# Altium schematic sheet Kevin16437_wheel_legged_robot__hardware_Altium_Powerborad_Powerborad_Board1_Schematic1__1_P1.schdoc
size 309 x 223 mm; Symbol: Sheet-Symbol_A4; Device: Sheet-Symbol_A4; Company: 嘉立创EDA; Version: V1.0; Page Size: A4; @Project Name: CAN分板; @Page Count: 1; @Update Date: 2024-08-21; @Create Date: 2024-08-21; @Schematic Name: Schematic1; @Page No: 1; @Page Name: P1; @Board Name: Board1; @Create Time: 05:50:06; @Update Time: 14:13:02
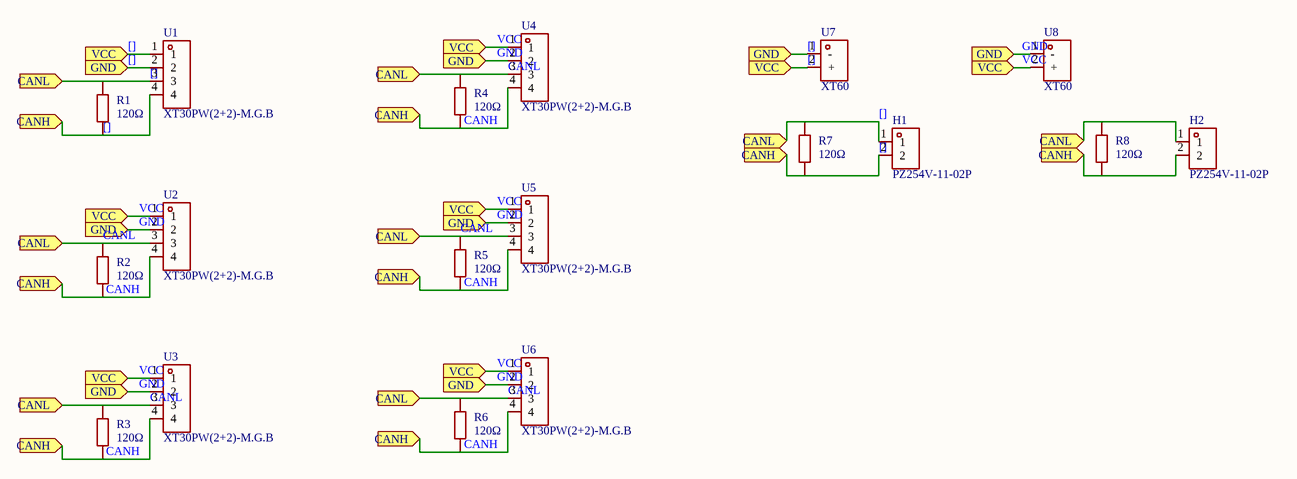
[diagram p0: Kevin16437_wheel_legged_robot__hardware_Altium_Powerborad_Powerborad_Board1_Schematic1__1_P1.schdoc]

## Parts
H1  PZ254V-11-02P  [HDR-TH_2P-P2.54-V-M]  (value not drawn)
H2  PZ254V-11-02P  [HDR-TH_2P-P2.54-V-M]  (value not drawn)
R1  120Ω  [R0805]  (value not drawn)
R2  120Ω  [R0805]  (value not drawn)
R3  120Ω  [R0805]  (value not drawn)
R4  120Ω  [R0805]  (value not drawn)
R5  120Ω  [R0805]  (value not drawn)
R6  120Ω  [R0805]  (value not drawn)
R7  120Ω  [R0805]  (value not drawn)
R8  120Ω  [R0805]  (value not drawn)
U1  XT30PW(2+2)-M.G.B  [CONN-TH_4P-XT30PW-M]  (value not drawn)
U2  XT30PW(2+2)-M.G.B  [CONN-TH_4P-XT30PW-M]  (value not drawn)
U3  XT30PW(2+2)-M.G.B  [CONN-TH_4P-XT30PW-M]  (value not drawn)
U4  XT30PW(2+2)-M.G.B  [CONN-TH_4P-XT30PW-M]  (value not drawn)
U5  XT30PW(2+2)-M.G.B  [CONN-TH_4P-XT30PW-M]  (value not drawn)
U6  XT30PW(2+2)-M.G.B  [CONN-TH_4P-XT30PW-M]  (value not drawn)
U7  XT60  [CONN-TH_XT60]  (value not drawn)
U8  XT60  [CONN-TH_XT60]  (value not drawn)

## Ports
CANH (in), CANL (in), GND (in), VCC (in)

## Nets
[]: H1.1 H1.2 H2.1 H2.2 R1.1 R1.2 R2.1 R2.2 R3.1 R3.2 R4.1 R4.2 R5.1 R5.2 R6.1 R6.2 R7.1 R7.2 R8.1 R8.2 U1.1 U1.2 U1.3 U1.4 U2.1 U2.2 U2.3 U2.4 U3.1 U3.2 U3.3 U3.4 U4.1 U4.2 U4.3 U4.4 U5.1 U5.2 U5.3 U5.4 U6.1 U6.2 U6.3 U6.4 U7.1(-) U7.2(+) U8.1(-) U8.2(+) ; port VCC, port GND, port CANL, port CANH  [also labelled CANH, CANL, GND, VCC]

## Notes on the sheet
- 1
- 2
- 3
- 4
- 5
- 6
- A
- B
- C
- 原理图
- Schematic1
- 创建日期
- 更新日期
- 2024-08-21
- 审阅
- 绘制
- 图页
- P1
- 物料编码
- CAN分板
- D
- 版本
- 尺寸
- 页
- 共
- V1.0
- A4
- 嘉立创EDA

## Library data of the parts
H1 H2 = PZ254V-11-02P: 插针结构:1x2P;间距:2.54mm;行距:-;圆针/方针:方针;安装类型:直插;排数:单排;总PIN位数:2P;额定电流:-;额定电压:-;配合针长度:6mm;塑高:2.5mm;端接针长度:3mm;触头材质:黄铜;触头镀层:-;工作温度范围:-40℃~+105℃;颜色:黑色;; Manufacturer: XFCN(兴飞); Add into BOM: yes; Pin Structure: 1x2P; Pitch: 2.54mm; Circluar Pins/Square Pins: 方针; Symbol: PZ254V-11-02P; Device: PZ254V-11-02P; Supplier: LCSC; Supplier Part: C492401; Manufacturer Part: PZ254V-11-02P; JLCPCB Part Class: 扩展库; LCSC Part Name: 间距:2.54mm 1x2P 直插 方针; Supplier Footprint: 插件,P=2.54mm; Datasheet: https://atta.szlcsc.com/upload/public/pdf/source/20200309/C492401_A812433581A9B211A7FFA413ADDFF0E5.pdf; Convert to PCB: yes; Row Spacing: -; Mounting Type: 直插; Number of Rows: 单排; Number of Pins: 2P; Current Rating (Max): -; Voltage Rating (Max): -; Length of Mating Pin: 6mm; Insulation Height: 2.5mm; Length of End Connection Pin: 3mm; Contact Material: 黄铜; Contact Plating: -; Operating Temperature Range: -40℃~+105℃; Color: 黑色
R1-R8 = 0805W8F1200T5E: 电阻类型:厚膜电阻;阻值:120Ω;精度:±1%;功率:125mW;最大工作电压:150V;温度系数:±100ppm/℃;; Manufacturer: UNI-ROYAL(厚声); Add into BOM: yes; Tolerance: ±1%; Power(Watts): 125mW; Overload Voltage (Max): 150V; Symbol: 0805W8F1200T5E; Device: 0805W8F1200T5E; Supplier: LCSC; Manufacturer Part: 0805W8F1200T5E; Supplier Part: C17437; Value: 120Ω; JLCPCB Part Class: 基础库; LCSC Part Name: 120Ω ±1% 125mW 厚膜电阻; Supplier Footprint: 0805; Datasheet: https://atta.szlcsc.com/upload/public/pdf/source/20200306/C422600_1E6D84923E4A46A82E41ADD87F860B5C.pdf; Convert to PCB: yes; Type: 厚膜电阻; Temperature Coefficient: ±100ppm/℃; Operating Temperature Range: -55℃~+155℃
U1-U6 = XT30PW(2+2)-M.G.B: Manufacturer: AMASS(艾迈斯); Symbol: XT30(2+2)PW-M.G.B; Add into BOM: yes; Device: XT30PW(2+2)-M.G.B; LCSC Part Name: XT30PW(2+2)功率数据混合插头公金黑PCB弯插; Supplier Part: C19268030; Manufacturer Part: XT30PW(2+2)-M.G.B; Supplier Footprint: -; JLCPCB Part Class: 扩展库; Datasheet: https://atta.szlcsc.com/upload/public/pdf/source/20240112/A815AE62CB016131F8636555ECBDABF7.pdf; Supplier: LCSC; Convert to PCB: yes
U7 U8 = XT60: 类别:-;类型1:-;; Manufacturer: AMASS(艾迈斯); Add into BOM: yes; Brand: 艾迈斯; InterfaceType: 公头; specifications: 3.5mm; Symbol: XT60; Device: XT60; LCSC Part Name: AMASS(艾迈斯) XT60模型插头 3.5mm镀金香蕉头公头（电调端）XT60-M; Supplier Part: C98733; Manufacturer Part: XT60; Supplier Footprint: -; JLCPCB Part Class: 扩展库; Datasheet: https://atta.szlcsc.com/upload/public/pdf/source/20170606/1496716524919.pdf; Supplier: LCSC; Convert to PCB: yes; Model: XT60; Power: -; Output: -; Input: -; Size: -; Interface: -; Type: 香蕉头; Colour: 黄色; MaximumCurrent: -; RatedVoltage: -; Type1: -; NumberOfUSBHoles: -; MetalMaterial: -; InsulationMaterial: -; RatedCurrent: -; RecommendedWireGauge: -; FlameRetardantGrade: -; contact resistance: -; Belt length: -